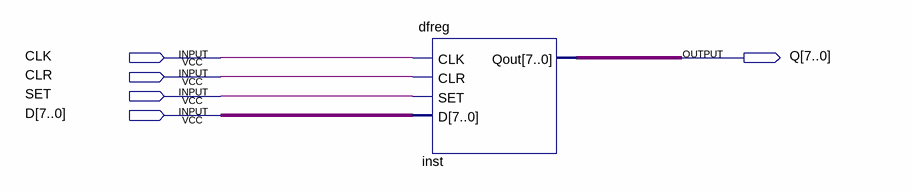
[diagram p0: schematic sheet]
// Quartus schematic reg.bdf as structural Verilog: 1 symbols, 5 pins
module \reg  (
  input  CLK,
  input  CLR,
  input  SET,
  input  [7:0] D,
  output [7:0] Q
);

  dfreg inst (.CLK(CLK), .CLR(CLR), .SET(SET), .D(D), .Qout(Q));
endmodule
